# Altium project KNX-MultiExt-1_3.PrjPcb
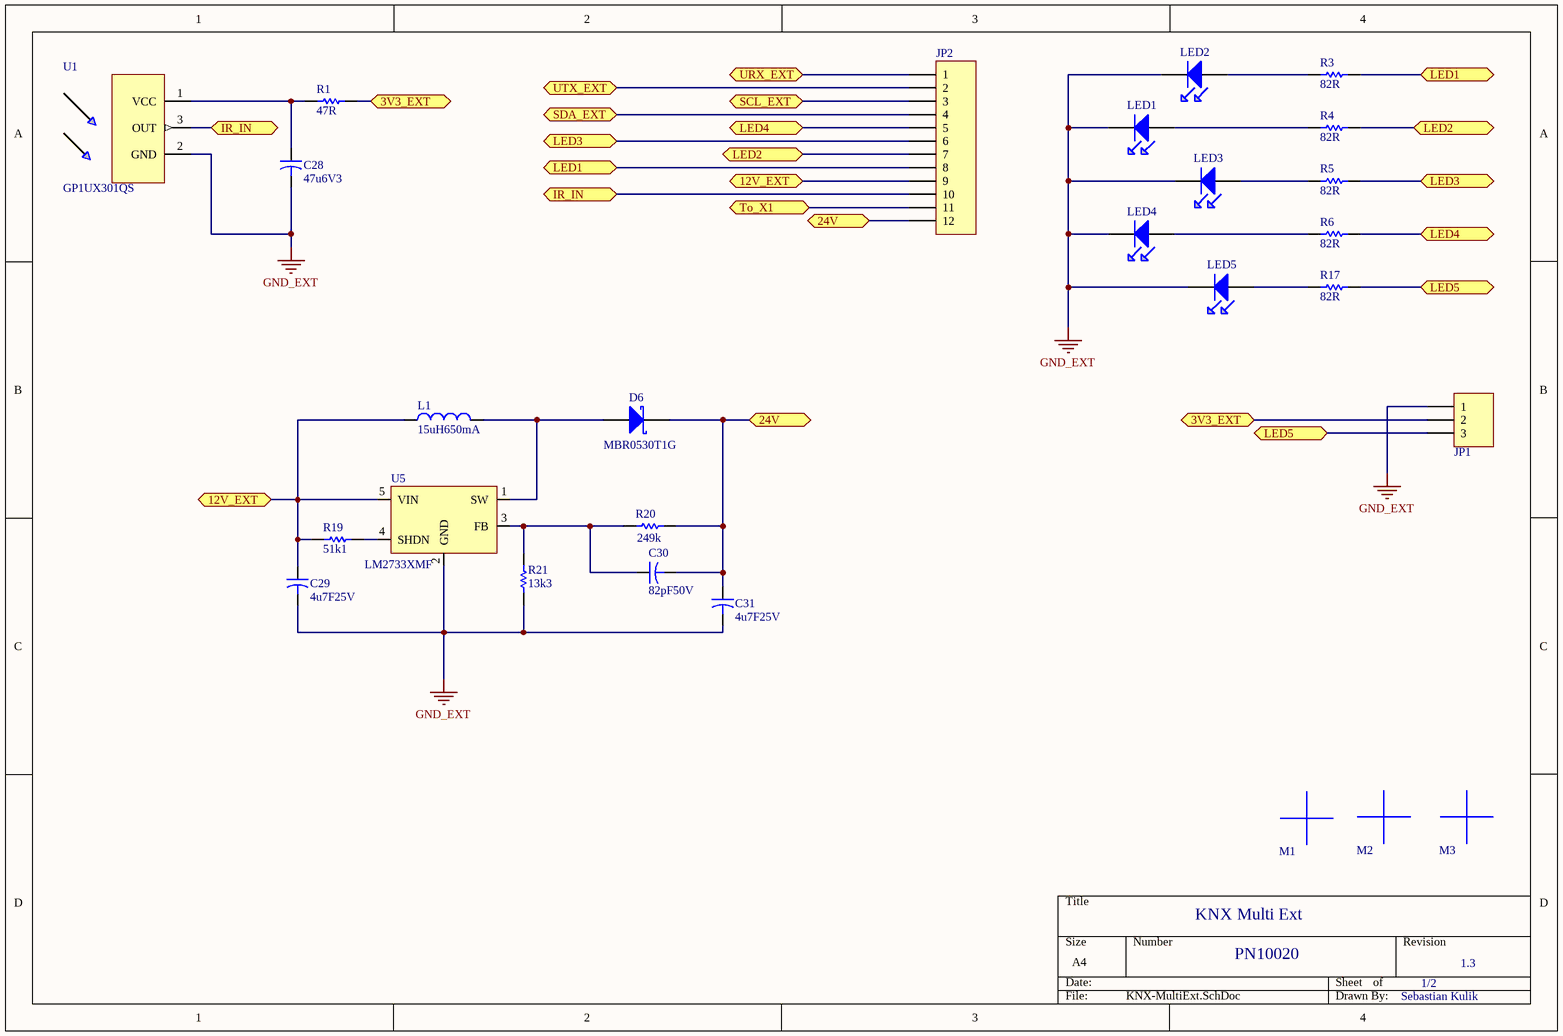
[diagram p0: KNX-MultiExt.SchDoc]
2 sheets, 40 parts. Net scope: flat (ports and power ports of the same name join across sheets).
Board file: KNX-MultiExt.PcbDoc
Sheets:
  KNX-MultiExt.SchDoc
  KNX-MultiExt_2.SchDoc

## Sheet KNX-MultiExt.SchDoc
size A4

### Parts
C28  value 47u6V3  [C0805]  (hidden comment: 47u6V3_0805)
C29  value 4u7F25V  [C0805]  (hidden comment: 4u7F25V_0805_Murata)
C30  value 82pF50V  [C0805]  (hidden comment: 82pF50V_0805)
C31  value 4u7F25V  [C0805]  (hidden comment: 4u7F25V_0805)
D6  MBR0530T1G  [SOD123]
JP1  Plug_3_90_2.54  [HDR1X3-DOWN]  (value not drawn)
JP2  Plug_12_90_2.54  [HDR1X12_2.54-Down]  (value not drawn)
L1  value 15uH650mA  [WE-TPC-3816]  (hidden comment: 15uH-WE-TPC)
LED1  HSMG-120-Y  [HSMA-120-OR]  (value not drawn)
LED2  HSMG-120-GR  [HSMA-120-G]  (value not drawn)
LED3  HSMG-120-Y  [HSMA-120-OR]  (value not drawn)
LED4  HSMG-120-Y  [HSMA-120-OR]  (value not drawn)
LED5  HSMG-120-Y  [HSMA-120-OR]  (value not drawn)
M1  PasteMark  [Mark-3mm]  (value not drawn)
M2  PasteMark  [Mark-3mm]  (value not drawn)
M3  PasteMark  [Mark-3mm]  (value not drawn)
R1  value 47R  [R0603(1608)]  (hidden comment: 47R_0603)
R3  value 82R  [R0603(1608)]  (hidden comment: 82R_0603)
R4  value 82R  [R0603(1608)]  (hidden comment: 82R_0603)
R5  value 82R  [R0603(1608)]  (hidden comment: 82R_0603)
R6  value 82R  [R0603(1608)]  (hidden comment: 82R_0603)
R17  value 82R  [R0603(1608)]  (hidden comment: 82R_0603)
R19  value 51k1  [R0402]  (hidden comment: 51k1_0402)
R20  value 249k  [R0402]  (hidden comment: 249k_0402)
R21  value 13k3  [R0402]  (hidden comment: 13k3_0402)
U1  GP1UX301QS  [IR-GP]
U5  LM2733XMF  [PDSO-G5]

### Ports
3V3_EXT, 12V_EXT, 24V, IR_IN, LED1, LED2, LED3, LED4, LED5, SCL_EXT, SDA_EXT, To_X1, URX_EXT, UTX_EXT

### Nets
GND_EXT: C28.2 C29.2 C31.2 JP1.1 LED1.1(K) LED2.1(K) LED3.1(K) LED4.1(K) LED5.1(K) R21.1 U1.2(GND) U5.2(GND)
NetC12_1: JP1.2 R1.2 ; port 3V3_EXT
NetC28_1: C28.1 R1.1 U1.1(VCC)
NetC29_1: C29.1 JP2.9 L1.1 R19.1 U5.5(VIN) ; port 12V_EXT
NetC30_1: C30.1 R20.1 R21.2 U5.3(FB)
NetC30_2: C30.2 C31.1 D6.1(K) JP2.12 R20.2 ; port 24V
NetD6_2: D6.2(A) L1.2 U5.1(SW)
NetJP1_3: JP1.3 R17.2 ; port LED5
NetJP2_1: JP2.1 ; port URX_EXT
NetJP2_2: JP2.2 ; port UTX_EXT
NetJP2_3: JP2.3 ; port SCL_EXT
NetJP2_4: JP2.4 ; port SDA_EXT
NetJP2_5: JP2.5 R6.2 ; port LED4
NetJP2_6: JP2.6 R5.2 ; port LED3
NetJP2_7: JP2.7 R4.2 ; port LED2
NetJP2_8: JP2.8 R3.2 ; port LED1
NetJP2_10: JP2.10 U1.3(OUT) ; port IR_IN
NetJP2_11: JP2.11 ; port To_X1
NetLED1_2: LED1.2(A) R4.1
NetLED2_2: LED2.2(A) R3.1
NetLED3_2: LED3.2(A) R5.1
NetLED4_2: LED4.2(A) R6.1
NetLED5_2: LED5.2(A) R17.1
NetR19_2: R19.2 U5.4(SHDN)

### Notes on the sheet
- KNX Multi Ext
- PN10020
- 1/2
- 1.3
- Sebastian Kulik

### Library data of the parts
C28 = 47u6V3_0805: Kemet  C series, X5R, 20%, 6.3V; Deliverer PartNr: 1572633RL; Manufacturer PartNr: C0805C476M9PACTU; Deliverer: Farnell; TDFE-PN: C0040; Published: 18.02.2014; Part Description: Kemet  C series, X5R, 20%, 6.3V; Publisher: Sebastian Kulik; PackageDescription: C0805; Manufacturer: Kemet
C29 = 4u7F25V_0805_Murata: GRM series, X5R, 10%, 25V; Deliverer PartNr: 2362111; Manufacturer: Murata; Manufacturer PartNr: GRM21BR61E475MA12L; Deliverer: Farnell; TDFE-PN: C0045; Published: 13.02.2014; Part Description: GRM series, X5R, 10%, 25V; Publisher: Sebastian Kulik; PackageDescription: C0805
C30 = 82pF50V_0805: C0G series, 5%, 50V; Deliverer PartNr: 2280684; Manufacturer: AVX; Manufacturer PartNr: 08055A820JAT2A; Deliverer: Farnell; TDE-PN: C0047; Published: 30.06.2014; Part Description: C0G series, 5%, 50V; Publisher: Sebastian Kulik; PackageDescription: C0805
C31 = 4u7F25V_0805: TDK  C series, X7R, 10%, 25V; Deliverer PartNr: 2346943RL; Manufacturer PartNr: C2012X7R1E475K125AB; Deliverer: Farnell; TDE-PN: C0035; Published: 13.02.2014; Part Description: TDK  C series, X7R, 10%, 25V; Publisher: Sebastian Kulik; PackageDescription: C0805; Manufacturer: TDK
D6 = MBR0530T1G: Diode Schottky,2A,40V; Deliverer PartNr: 2317649; Manufacturer: Rohm; TDE-PN: DIS0026; Deliverer: Farnell; Published: 30.06.2014; PackageReference: SOD123; Publisher: Sebastian Kulik; PackageDescription: SOD123; Manufacturer PartNr: MBR0530T1G
JP1 = Plug_3_90_2.54: Plug,-3-Pin; Manufacturer: WE; Manufacturer PartNr: 61300311021; Deliverer PartNr: 2356177; Deliverer: Farnell; TDE-PN: CON0011; Publisher: Sebastian Kulik
JP2 = Plug_12_90_2.54: Plug, 11-Pin; Manufacturer PartNr: 61301211021; Manufacturer: WE; TDE-PN: CON0019; LatestRevisionDate: 27.05.2014; LatestRevisionNote: Re-released for DXP Platform.; Publisher: Sebastian Kulik; Deliverer: WE; Deliverer PartNr: 61301211021
L1 = 15uH-WE-TPC: Coil, 15uH, 0.65A; Deliverer PartNr: 744031150; Deliverer: WE; TDE-PN: P0023; Manufacturer: WE; Manufacturer PartNr: 744031150; Published: 30.06.2014; Publisher: Sebastian Kulik
LED1 LED3-LED5 = HSMG-120-Y: LED, 90°, yellow; Manufacturer PartNr: HSMG-C120; Deliverer PartNr: 1058355; Manufacturer: Avago; TDE-PN: DIS0012; Deliverer: Farnell; Published: 18.02.2014; PackageReference: HSMA120Y; Publisher: Sebastian Kulik; PackageDescription: HSMA120Y
LED2 = HSMG-120-GR: LED, 90°, green; Manufacturer PartNr: HSMG-C120; Deliverer PartNr: 1058364; Manufacturer: Avago; TDE-PN: DIS0011; Deliverer: Farnell; Published: 18.02.2014; PackageReference: HSMA120G; Publisher: Sebastian Kulik; PackageDescription: HSMA120G
M1-M3 = Mark
R1 = 47R_0603: Vishay, CRCW series, 100mW, 1%; Manufacturer PartNr: CRCW060347R0FKEA; Deliverer PartNr: 1652835; TDE-PN: R0039; Deliverer: Farnell; Published: 18.02.2014; Publisher: Sebastian Kulik; PackageDescription: 0603; Manufacturer: Vishay; Part Desicription: Vishay, CRCW series, 100mW, 1%
R3-R6 R17 = 82R_0603: Vishay, CRCW series, 100mW, 1%; Manufacturer PartNr: CRCW060382R0FKEA; Deliverer PartNr: 2122228; TDE-PN: R0040; Deliverer: Farnell; Published: 18.02.2014; Publisher: Sebastian Kulik; PackageDescription: 0603; Manufacturer: Vishay; Part Desicription: Vishay, CRCW series, 100mW, 1%
R19 = 51k1_0402: Vishay CRCW series, 63mW, 1%; Manufacturer PartNr: CRCW040251K1FKED; Deliverer PartNr: 1652806; TDE-PN: R0046; Deliverer: Farnell; Published: 30.06.2014; Publisher: Sebastian Kulik; PackageDescription: 0402; Manufacturer: Vishay; Part Description: Vishay CRCW series, 63mW, 1%
R20 = 249k_0402: Vishay CRCW series, 63mW, 1%; Manufacturer PartNr: CRCW0402249KFKED; Deliverer PartNr: 2140966RL; TDE-PN: R0048; Deliverer: Farnell; Published: 30.06.2014; PackageReference: 0402; Publisher: Sebastian Kulik; PackageDescription: 0402; Manufacturer: Vishay; Part Description: Vishay CRCW series, 63mW, 1%
R21 = 13k3_0402: Vishay CRCW series, 63mW, 1%; Manufacturer PartNr: CRCW040213K3FKED; Deliverer PartNr: 1652750RL; TDE-PN: R0047; Deliverer: Farnell; Published: 30.06.2014; PackageReference: 0402; Publisher: Sebastian Kulik; PackageDescription: 0402; Manufacturer: Vishay; Part Description: Vishay CRCW series, 63mW, 1%
U1 = GP1UX301QS: IR reseiver; Deliverer PartNr: 666-6542P; Manufacturer: Sharp; Deliverer: RS Components; TDE-PN: IC0039; Published: 17.02.2014; Publisher: Sebastian Kulik; Manufacturer PartNr: GP1UX301QS; PackageDescription: IR-GP
U5 = LM2733XMF: TI, buck boost converter, 1A max; Deliverer PartNr: LM2733XMF/NOPB; Deliverer: EBV; TDE-PN: IC0051; Published: 30.06.2014; PackageReference: PDSO-G5; Publisher: Sebastian Kulik; Manufacturer PartNr: LM2733XMF/NOPB; Manufacturer: TI

## Sheet KNX-MultiExt_2.SchDoc
size A4
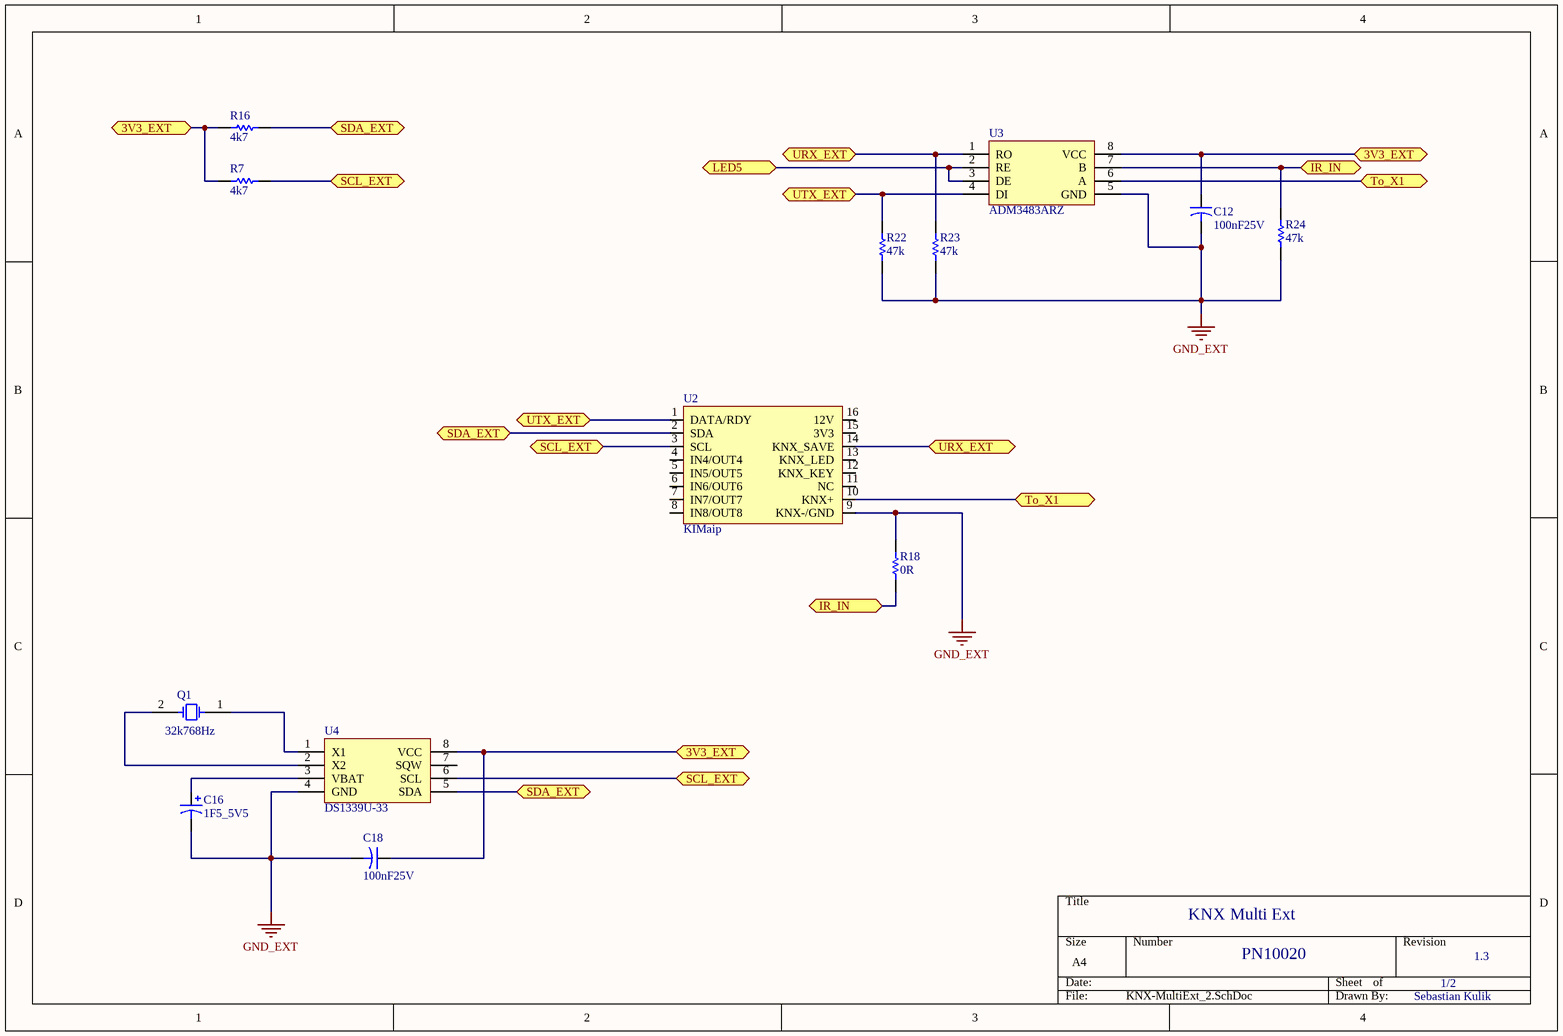
[diagram p1: KNX-MultiExt_2.SchDoc]

### Parts
C12  value 100nF25V  [C0402]  (hidden comment: 100nF25V_0402)
C16  value 1F5_5V5  [Goldcap_B]  (hidden comment: 1F5_5V5_POL)
C18  value 100nF25V  [C0402]  (hidden comment: 100nF25V_0402)
Q1  value 32k768Hz  [VT-200]  (hidden comment: Crystal_32k768Hz)
R7  value 4k7  [R0402]  (hidden comment: 4k7_0402)
R16  value 4k7  [R0402]  (hidden comment: 4k7_0402)
R18  value 0R  [R0603(1608)]  (hidden comment: 0R_0603)
R22  value 47k  [R0402]  (hidden comment: 47k_0402)
R23  value 47k  [R0402]  (hidden comment: 47k_0402)
R24  value 47k  [R0402]  (hidden comment: 47k_0402)
U2  KIMaip  [KIMaip]
U3  ADM3483ARZ  [SOIC8_N]
U4  DS1339U-33  [uSOP8]

### Ports
3V3_EXT, IR_IN, LED5, SCL_EXT, SDA_EXT, To_X1, URX_EXT, UTX_EXT

### Nets
GND_EXT: C12.2 C16.2 C18.2 R18.2 R22.1 R23.1 R24.1 U2.9(KNX-/GND) U3.5(GND) U4.4(GND)
NetC12_1: C12.1 C18.1 R7.1 R16.1 U3.8(VCC) U4.8(VCC) ; port 3V3_EXT
NetC16_1: C16.1 U4.3(VBAT)
NetJP1_3: U3.2(RE) U3.3(DE) ; port LED5
NetJP2_1: R23.2 U2.14(KNX_SAVE) U3.1(RO) ; port URX_EXT
NetJP2_2: R22.2 U2.1(DATA/RDY) U3.4(DI) ; port UTX_EXT
NetJP2_3: R7.2 U2.3(SCL) U4.6(SCL) ; port SCL_EXT
NetJP2_4: R16.2 U2.2(SDA) U4.5(SDA) ; port SDA_EXT
NetJP2_10: R18.1 R24.2 U3.7(B) ; port IR_IN
NetJP2_11: U2.10(KNX+) U3.6(A) ; port To_X1
NetQ1_1: Q1.1(E/D) U4.1(X1)
NetQ1_2: Q1.2(GND) U4.2(X2)

Not connected (* = marked no-connect by the designer): U2 4(IN4/OUT4) 5(IN5/OUT5) 6(IN6/OUT6) 7(IN7/OUT7) 8(IN8/OUT8) 11(NC) 12(KNX_KEY) 13(KNX_LED) 15(3V3) 16(12V); U4 7(SQW)

### Notes on the sheet
- KNX Multi Ext
- PN10020
- 1/2
- 1.3
- Sebastian Kulik

### Library data of the parts
C12 C18 = 100nF25V_0402: AVX, X5R, 10%, 25V; Deliverer PartNr: 1833862; Manufacturer PartNr: 04023D104KAT2A; Deliverer: Farnell; TDE-PN: C0036; Published: 09.12.2014; Part Description: AVX, X5R, 10%, 25V; Publisher: Sebastian Kulik; PackageDescription: C0402; Manufacturer: AVX
C16 = 1F5_5V5_POL: Panasonic, F series; Deliverer PartNr: 1305065; Manufacturer PartNr: EECF5R5U155; Deliverer: Farnell; TDFE-PN: C0042; Published: 26.02.2014; Part Description: Panasonic, F series; Publisher: Sebastian Kulik; PackageDescription: Goldcap-B; Manufacturer: Panasonic
Q1 = Crystal_32k768Hz: Crystal, 32.768kHz; Deliverer PartNr: 1607117; Manufacturer PartNr: VT-200-F; Manufacturer: Seiko; Deliverer: Farnell; TDE-PN: P0018; Published: 14.02.2014; PackageReference: VT-200; Publisher: Sebastian Kulik
R7 R16 = 4k7_0402: Vishay CRCW series, 63mW, 1%; Manufacturer PartNr: CRCW04024K70FKED; Deliverer PartNr: 2121688; TDE-PN: R0009; Deliverer: Farnell; Published: 25.02.2014; PackageReference: 0402; Publisher: Sebastian Kulik; PackageDescription: 0402; Manufacturer: Vishay; Part Description: Vishay CRCW series, 63mW, 1%
R18 = 0R_0603: Vishay, CRCW series, 100mW; Manufacturer PartNr: CRCW06030000ZSTA; Deliverer PartNr: 1652824; TDE-PN: R0041; Deliverer: Farnell; Published: 18.02.2014; Publisher: Sebastian Kulik; PackageDescription: 0603; Manufacturer: Vishay; Part Desicription: Vishay, CRCW series, 100mW
R22-R24 = 47k_0402: Vishay CRCW series, 63mW, 1%; Manufacturer PartNr: CRCW040247K0JNEAIF; Deliverer PartNr: 1739115; TDE-PN: R0020; Deliverer: Farnell; Published: 07.04.2014; PackageReference: 0402; Publisher: Sebastian Kulik; PackageDescription: 0402; Manufacturer: Vishay; Part Description: Vishay CRCW series, 63mW, 1%
U2 = KIMaip: PoE, 12V; Manufacturer: Tapko; TDE-PN: IC0040; Published: 25.02.2014; Deliverer PartNr: -; Deliverer: -; PackageReference: TSSOP8; Publisher: Sebastian Kulik; Manufacturer PartNr: KIMaip
U3 = ADM3483ARZ: Transceiver, RS485/422; Deliverer PartNr: 1274169; Manufacturer: ADI; Deliverer: Farnell; TDE-PN: IC0041; Published: 25.02.2014; PackageReference: TSSOP8; Publisher: Sebastian Kulik; Manufacturer PartNr: ADM3483ARZ
U4 = DS1339U-33: RTC; Deliverer PartNr: 1379717; Manufacturer: Dallas; Deliverer: Farnell; TDE-PN: IC0042; Published: 25.02.2014; PackageReference: TSSOP8; Publisher: Sebastian Kulik; Manufacturer PartNr: DS1339U-33

## Nets that join several sheets
GND_EXT: KNX-MultiExt (12 pins), KNX-MultiExt_2 (10 pins)
NetC12_1: KNX-MultiExt (JP1.2 R1.2), KNX-MultiExt_2 (6 pins)
NetJP1_3: KNX-MultiExt (JP1.3 R17.2), KNX-MultiExt_2 (U3.2 U3.3)
NetJP2_1: KNX-MultiExt (JP2.1), KNX-MultiExt_2 (R23.2 U2.14 U3.1)
NetJP2_2: KNX-MultiExt (JP2.2), KNX-MultiExt_2 (R22.2 U2.1 U3.4)
NetJP2_3: KNX-MultiExt (JP2.3), KNX-MultiExt_2 (R7.2 U2.3 U4.6)
NetJP2_4: KNX-MultiExt (JP2.4), KNX-MultiExt_2 (R16.2 U2.2 U4.5)
NetJP2_10: KNX-MultiExt (JP2.10 U1.3), KNX-MultiExt_2 (R18.1 R24.2 U3.7)
NetJP2_11: KNX-MultiExt (JP2.11), KNX-MultiExt_2 (U2.10 U3.6)

## Assembly variants
KNX-GW: not fitted C12 C16 C18 C29 C30 C31 D6 L1 LED1 LED2 Q1 R19 R20 R21 U1 U3 U4 U5
MultiSensor: not fitted C16 C18 C29 C30 C31 D6 LED1 LED2 Q1 R18 R19 R20 R21 R22 R23 U1 U4 U5
WS: not fitted C12 R18 R22 R23 U1 U2 U3
DIMM: not fitted C12 C16 C18 C29 C30 C31 D6 L1 LED1 LED2 Q1 R1 R7 R16 R18 R19 R20 R21 R22 R23 U1 U2 U3 U4 U5
MMC: not fitted C12 C16 C18 C29 C30 C31 D6 L1 Q1 R7 R16 R18 R19 R20 R21 R22 R23 R24 U2 U3 U4 U5